# EAGLE design CNT_1_0 (EAGLE 8.3.2)
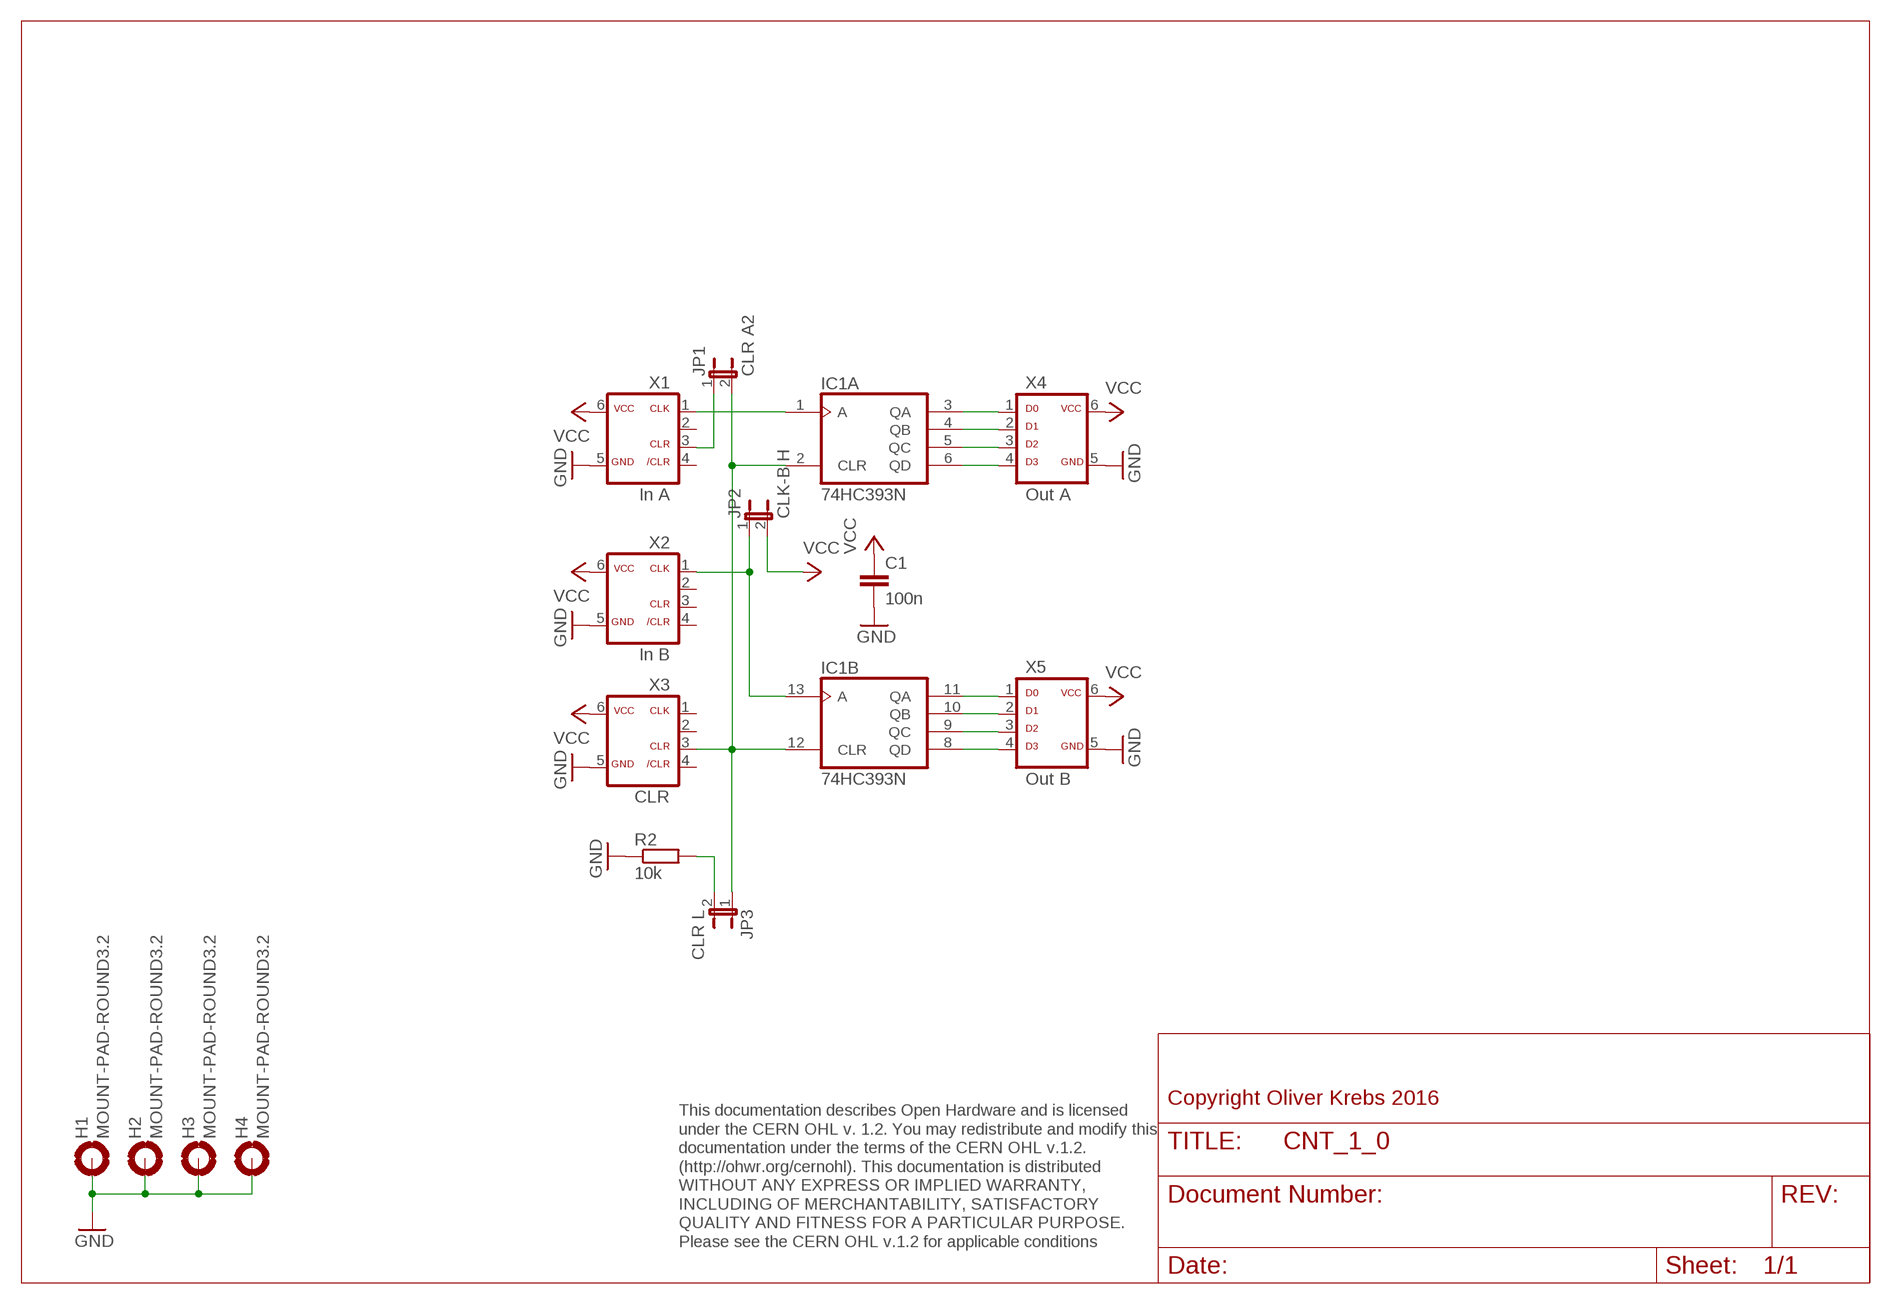
[diagram p0: schematic, sheet 1]

## Parts
C1  100n  C-EU050-025X075  [C050-025X075]
H1  MOUNT-PAD-ROUND3.2  [3,2-PAD]
H2  MOUNT-PAD-ROUND3.2  [3,2-PAD]
H3  MOUNT-PAD-ROUND3.2  [3,2-PAD]
H4  MOUNT-PAD-ROUND3.2  [3,2-PAD]
IC1  74HC393N  [DIL14]
JP1  CLR A2  JP1E  [JP1]
JP2  CLK-B H  JP1E  [JP1]
JP3  CLR L  JP1E  [JP1]
R2  10k  R-EU_0207/10  [0207/10]
X1  In A  ML6C  [ML-6]
X2  In B  ML6C  [ML-6]
X3  CLR  ML6C  [ML-6]
X4  Out A  ML6D  [ML-6]
X5  Out B  ML6D  [ML-6]

## Nets
GND: C1.2 H1.B3,2(MOUNT) H2.B3,2(MOUNT) H3.B3,2(MOUNT) H4.B3,2(MOUNT) R2.1 X1.5 X2.5 X3.5 X4.5 X5.5
N$1: IC1.3(A:QA) X4.1
N$2: IC1.4(A:QB) X4.2
N$3: IC1.5(A:QC) X4.3
N$4: IC1.6(A:QD) X4.4
N$5: IC1.1(A:A) X1.1
N$6: JP1.1 X1.3
N$9: IC1.2(A:CLR) IC1.12(B:CLR) JP1.2 JP3.1 X3.3
N$11: IC1.13(B:A) JP2.1 X2.1
N$13: IC1.11(B:QA) X5.1
N$15: IC1.10(B:QB) X5.2
N$16: IC1.9(B:QC) X5.3
N$17: IC1.8(B:QD) X5.4
N$19: JP3.2 R2.2
VCC: C1.1 JP2.2 X1.6 X2.6 X3.6 X4.6 X5.6
Unconnected: X1.2 X1.4 X2.2 X2.3 X2.4 X3.1 X3.2 X3.4

## Notes on the sheet
- Copyright Oliver Krebs 2016
- This documentation describes Open Hardware and is licensed 
  under the CERN OHL v. 1.2. You may redistribute and modify this 
  documentation under the terms of the CERN OHL v.1.2. 
  (http://ohwr.org/cernohl). This documentation is distributed
  WITHOUT ANY EXPRESS OR IMPLIED WARRANTY, 
  INCLUDING OF MERCHANTABILITY, SATISFACTORY 
  QUALITY AND FITNESS FOR A PARTICULAR PURPOSE. 
  Please see the CERN OHL v.1.2 for applicable conditions

## Power pins joined to a net without a drawn wire
GND: IC1.7(P:GND)
VCC: IC1.14(P:VCC)

## Library data of the parts
C1 = 01-my_rcl:C-EU: CAPACITOR, European symbol
H1-H4 = holes:MOUNT-PAD-ROUND: MOUNTING PAD, round
IC1 = 74xx-eu:74*393: Dual 4-bit decade and binary COUNTER
JP1-JP3 = jumper:JP1E: JUMPER
R2 = 01-my_rcl:R-EU_: RESISTOR, European symbol
X1-X3 = 01-my-con:ML6C
X4 X5 = 01-my-con:ML6D

## Board
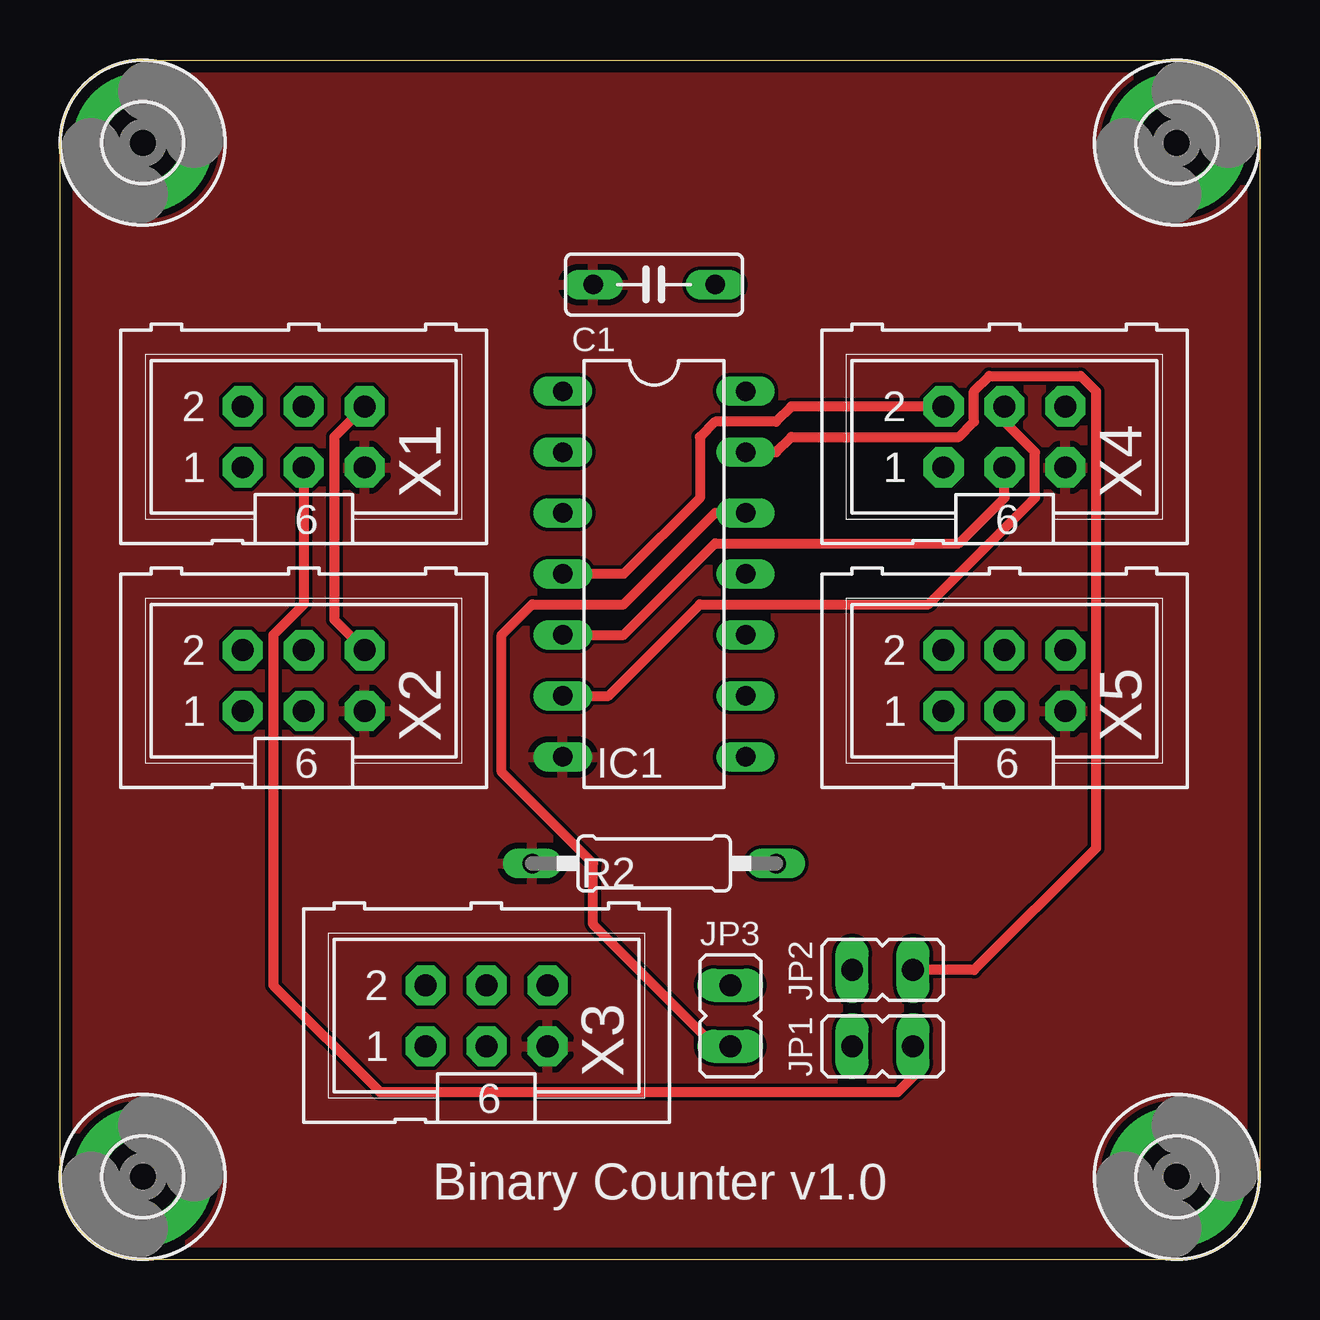
[diagram p1: board, top side]
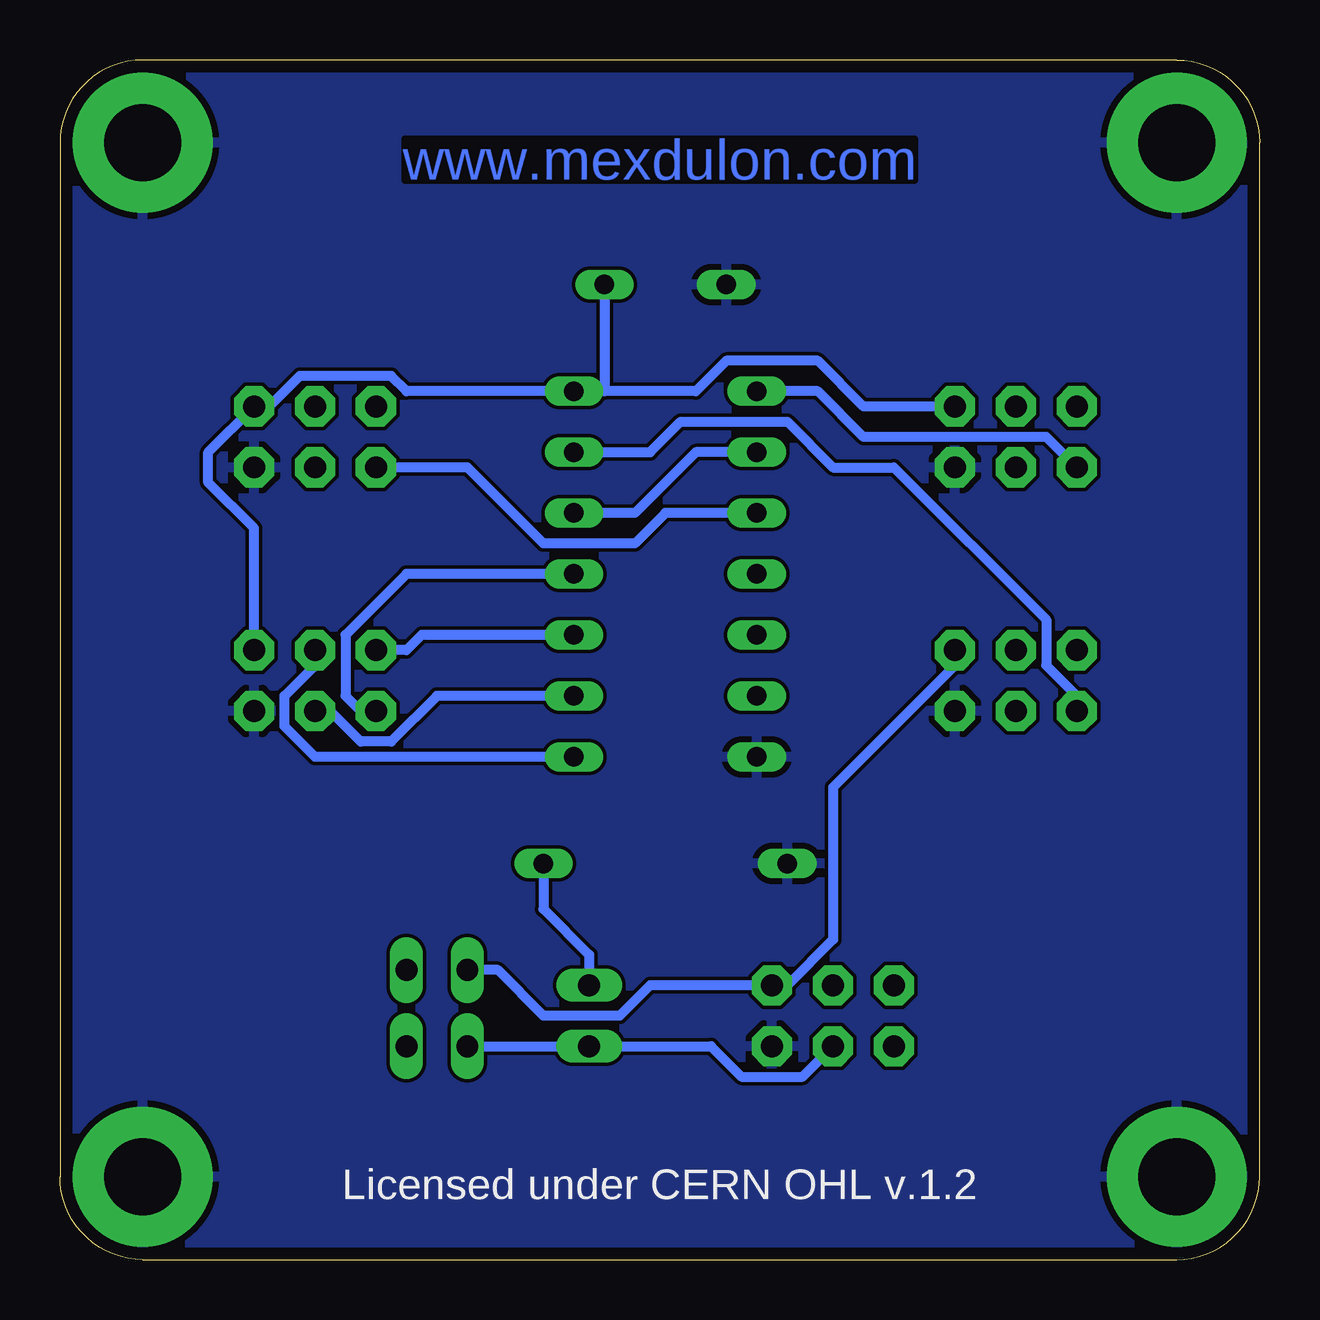
[diagram p2: board, bottom side, seen from below]

Size 50 x 50 mm. Coordinates in mm from the lower left corner, seen from the top.
Outline: 0,3.45 0,46.55 arc-90 3.45,50 46.55,50 arc-90 50,46.55 50,3.45 arc-90 46.55,0 3.45,0 arc-90 0,3.45
Copper layers (1*16): Top 0.035mm / dielectric 1.6mm / Bottom 0.035mm
Design rules "Elecrow_2-layer_PCB_eagle_rule": minimum track width 6mil, minimum drill 12mil, track to track 6mil, track to pad 6mil, pad to pad 6mil, via to via 8mil, smd to smd 0mil, copper to edge 20mil, drill to drill 10mil, minimum pad ring 6mil, minimum via ring 6mil, stop-mask expansion 0mil, vias tented up to drill 100mil, thermal gap 10mil

### Footprints (pad centres in the part's own frame; a part is rotated, then mirrored left to right if it is on the bottom)
C050-025X075 = drill 0.813 long: 1 -2.54,0; 2 2.54,0
3,2-PAD = drill 3.2 pad 5.842: B3,2 0,0
DIL14 = drill 0.813 long: 1 -7.62,-3.81; 2 -5.08,-3.81; 3 -2.54,-3.81; 4 0,-3.81; 5 2.54,-3.81; 6 5.08,-3.81; 7 7.62,-3.81; 8 7.62,3.81; 9 5.08,3.81; 10 2.54,3.81; 11 0,3.81; 12 -2.54,3.81; 13 -5.08,3.81; 14 -7.62,3.81
JP1 = drill 0.914 long: 1 0,-1.27; 2 0,1.27
0207/10 = drill 0.813 long: 1 -5.08,0; 2 5.08,0
ML-6 = drill 0.914 pad 1.676 octagon: 1 -2.54,-1.27; 2 -2.54,1.27; 3 0,-1.27; 4 0,1.27; 5 2.54,-1.27; 6 2.54,1.27

### Placement (x,y rotation side)
C1  24.77,40.64 180 top
H1  3.45,46.55 0 top
H2  3.45,3.45 0 top
H3  46.55,3.45 0 top
H4  46.55,46.55 0 top
IC1  24.77,28.57 270 top
JP1  34.29,8.89 90 top
JP2  34.29,12.06 90 top
JP3  27.94,10.16 0 top
R2  24.77,16.51 0 top
X1  10.16,34.29 0 top
X2  10.16,24.13 0 top
X3  17.78,10.16 0 top
X4  39.37,34.29 0 top
X5  39.37,24.13 0 top

### Tracks (layer width: path | path; a pad name or v marks a point on that pad's centre or on a via)
GND
  pour Bottom: 0,50.16 50.16,50.16 50.16,0 0,0
  pour Top: 0,50.16 50.16,50.16 50.16,0 0,0
N$1
  Bottom 0.406: IC1.3 24.77,31.11 26.04,29.84 29.84,29.84 33.02,33.02 X4.1
N$2
  Top 0.406: X4.2 30.48,35.56 29.84,34.92 27.3,34.92 26.67,34.29 26.67,31.75 23.5,28.57 IC1.4
N$3
  Top 0.406: IC1.5 23.5,26.04 27.3,29.84 37.47,29.84 39.37,31.75 X4.3
N$4
  Top 0.406: IC1.6 22.86,23.5 26.67,27.3 36.2,27.3 40.64,31.75 40.64,33.66 39.37,34.92 X4.4
N$5
  Bottom 0.406: X1.1 8.89,34.29 16.51,34.29 18.41,36.2 IC1.1
N$6
  Top 0.406: X1.3 10.16,27.3 8.89,26.04 8.89,11.43 13.34,6.99 34.92,6.99 35.56,7.62 JP1.1
N$9
  Top 0.406: JP3.1 27.3,8.89 22.23,13.97 22.23,16.51 18.41,20.32 18.41,26.04 19.68,27.3 23.5,27.3 27.3,31.11 IC1.12
  Bottom 0.406: IC1.2 23.5,33.66 26.04,31.11 IC1.12 | JP1.2 JP3.1 22.86,8.89 21.59,7.62 19.05,7.62 X3.3
N$11
  Top 0.406: IC1.13 29.84,33.66 30.48,34.29 37.47,34.29 38.1,34.92 38.1,36.2 38.73,36.83 42.55,36.83 43.18,36.2 43.18,17.14 38.1,12.06 JP2.1
  Bottom 0.406: IC1.13 25.4,33.66 24.13,34.92 19.68,34.92 17.78,33.02 15.24,33.02 8.89,26.67 8.89,24.77 7.62,23.5 X2.1
N$13
  Bottom 0.406: IC1.11 35.56,28.57 38.1,26.04 38.1,23.5 37.47,22.86 X5.1
N$15
  Bottom 0.406: IC1.10 34.92,26.04 35.56,25.4 X5.2
N$16
  Bottom 0.406: IC1.9 34.29,23.5 36.2,21.59 37.47,21.59 38.73,22.86 X5.3
N$17
  Bottom 0.406: IC1.8 39.37,20.95 40.64,22.23 40.64,23.5 39.37,24.77 X5.4
N$19
  Bottom 0.406: R2.2 29.84,14.61 27.94,12.7 JP3.2
VCC
  Top 0.406: X1.6 11.43,34.29 11.43,26.67 X2.6
  Bottom 0.406: X1.6 16.51,35.56 18.41,37.47 22.23,37.47 23.5,36.2 27.3,36.2 | 27.3,36.2 IC1.14 35.56,36.2 36.2,36.83 40.01,36.83 41.27,35.56 X4.6 43.81,33.66 43.81,32.38 41.91,30.48 X5.6 | C1.1 27.3,36.2 | JP2.2 31.75,12.06 29.84,10.16 26.67,10.16 25.4,11.43 X3.6 19.68,11.43 17.78,13.34 17.78,19.68 12.7,24.77 X2.6

### Text on the board
Bottom: www.mexdulon.com
tNames: Binary Counter v1.0
bNames: Licensed under CERN OHL v.1.2
200bmp: E:/Bilder/Elektronik/Modulion/Mexdulon/mexdulon_50x50_pcb.bmp